# Altium schematic sheet Headphone.SchDoc
size A4; Organization: Altium Limited; Address1: L3, 12a Rodborough Rd; Address2: Frenchs Forest; Address3: NSW; Address4: Australia 2086; DocumentNumber: 3; SheetNumber: 3; SheetTotal: 8
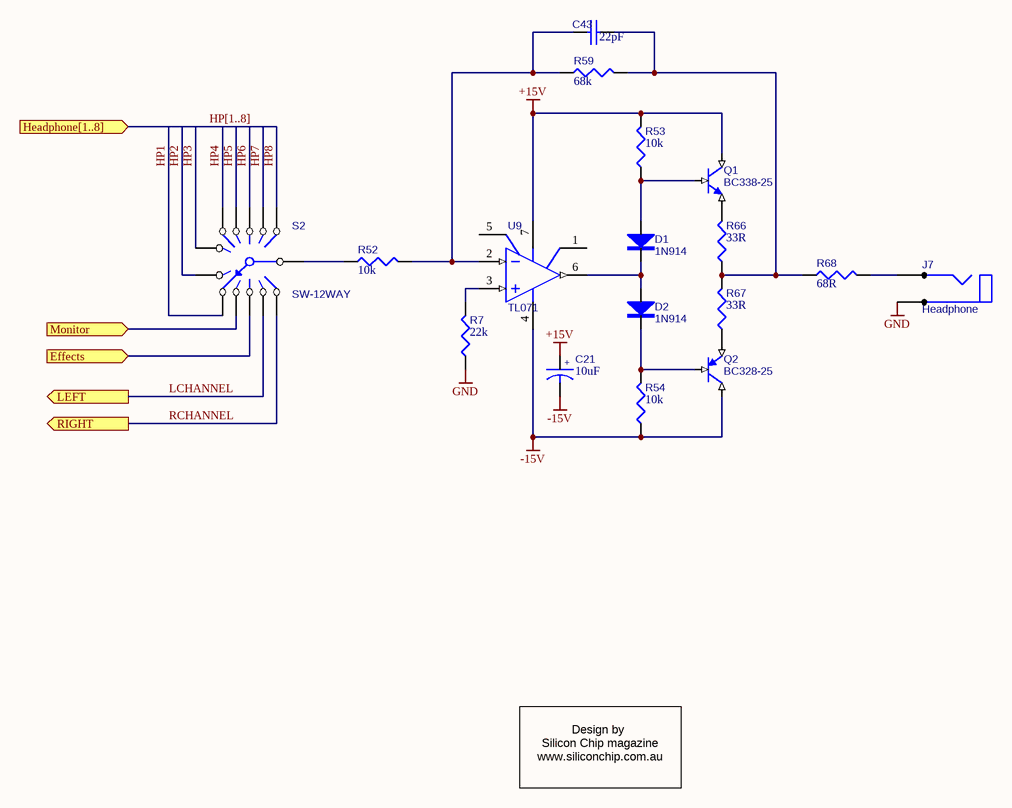
[diagram p0: Headphone.SchDoc]

## Parts
C21  10uF  [RB.2/.4]
C43  22pF  [RAD0.2]
D1  1N914  [DIODE0.4]
D2  1N914  [DIODE0.4]
J7  Headphone  [JACK-6.25MM]
Q1  BC338-25  [TO-92A]
Q2  BC328-25  [TO-92A]
R7  22k  [AXIAL0.4]
R52  10k  [AXIAL0.4]
R53  10k  [AXIAL0.4]
R54  10k  [AXIAL0.4]
R59  68k  [AXIAL0.4]
R66  33R  [AXIAL0.4]
R67  33R  [AXIAL0.4]
R68  68R  [AXIAL0.4]
S2  SW-12WAY  [SW-12WAY]
U9  TL071  [DIP8]

## Ports
Effects (in), Headphone[1..8] (in), LEFT (out), Monitor (in), RIGHT (out)

## Nets
+15V: C21.1 Q1.1(C) R53.2 U9.7(VCC+)
-15V: C21.2 Q2.1(C) R54.1 U9.4(VCC-)
GND: J7.3(C) R7.1
Effects: S2.10 ; port Effects
HP1: S2.8
HP2: S2.7
HP3: S2.6
HP4: S2.5
HP5: S2.4
HP6: S2.3
HP7: S2.2
HP8: S2.1
LCHANNEL: S2.11 ; port LEFT
Monitor: S2.9 ; port Monitor
RCHANNEL: S2.12 ; port RIGHT
NetC43_1: C43.1 R52.2 R59.1 U9.2(IN-)
NetC43_2: C43.2 R59.2 R66.1 R67.2 R68.1
NetD1_1: D1.1(A) Q1.2(B) R53.1
NetD1_2: D1.2(K) D2.1(A) U9.6(OUT)
NetD2_2: D2.2(K) Q2.2(B) R54.2
NetJ7_1: J7.1(A) R68.2
NetQ1_3: Q1.3(E) R66.2
NetQ2_3: Q2.3(E) R67.1
NetR7_2: R7.2 U9.3(IN+)
NetR52_1: R52.1 S2.13

Not connected (* = marked no-connect by the designer): U9 1(N1/O.S.) 5(O.S._N2)

## Buses and harness runs
bus HP[1..8] = port Headphone[1..8]

## Notes on the sheet
- Design by
  Silicon Chip magazine
  www.siliconchip.com.au
- Title
- Size:
- Date:
- A4
- Number:
- Time:
- Revision:
- Sheet
- of
- File:
- (in symbol CAPACITOR POL) +

## Library data of the parts
C21 = CAPACITOR POL: Bi-Polar Capacitor; Value: 10uF
C43 = CAP: Capacitor
D1 D2 = 1N914: Diode
J7 = PHONEJACK MONO
Q1 = BC338-25: NPN BJT
Q2 = BC328-25: PNP BJT
R7 R52-R54 R59 R66-R68 = RES1: Resistor
  R7: Value: 22k
  R52-R54: Value: 10k
  R59: Value: 68k
  R66 R67: Value: 33R
  R68: Value: 68R
U9 = TL071: Low-Noise  JFET-Input Operational Amplifiers